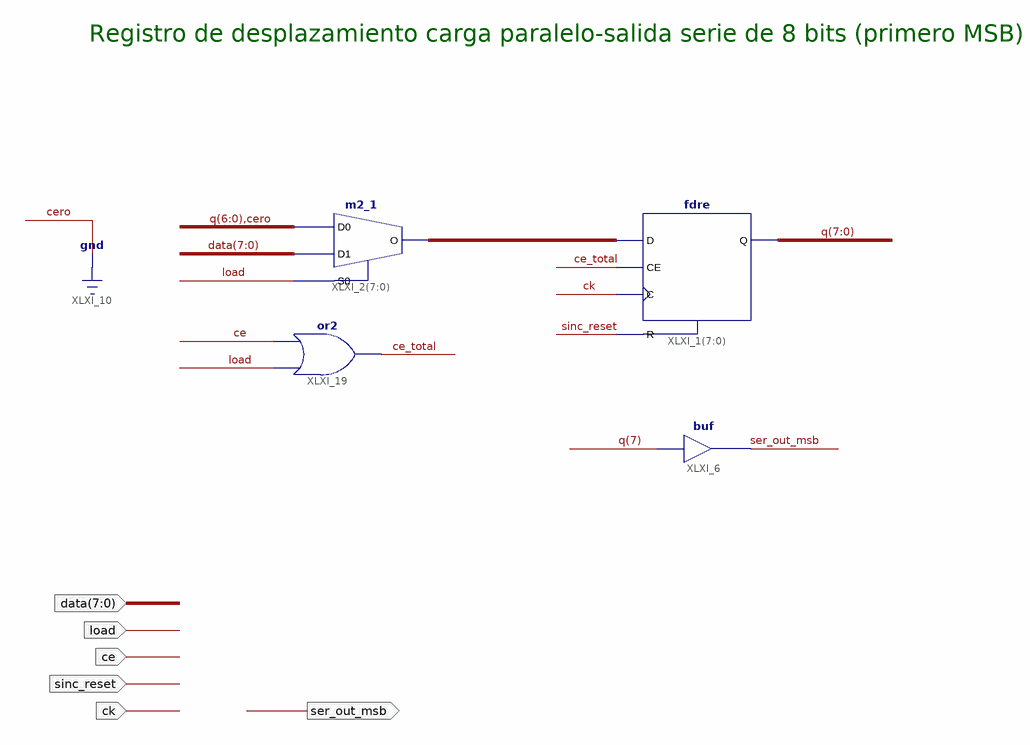
[diagram p0: schematic sheet 1]
// Xilinx ISE schematic regdesp8b.sch (spartan6) as structural Verilog: 4 symbols, 6 ports
module regdesp8b (
  input  ck,
  input  ce,
  input  sinc_reset,
  input  load,
  input  [7:0] data,
  output ser_out_msb
);

  wire ce_total;
  wire [7:0] q, XLXN_26;

  m2_1 XLXI_2[7:0] (.D0({q[6:0], 1'b0}), .D1(data), .S0(load), .O(XLXN_26));
  fdre XLXI_1[7:0] (.C(ck), .CE(ce_total), .D(XLXN_26), .R(sinc_reset), .Q(q));
  buf XLXI_6 (ser_out_msb, q[7]);
  or XLXI_19 (ce_total, load, ce);

  // Notes on the sheet:
  //   Registro de desplazamiento carga paralelo-salida serie de 8 bits (primero MSB)
endmodule
